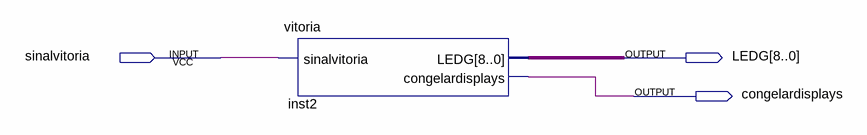
[diagram p0: schematic sheet]
// Quartus schematic esquematicotestevitoria.bdf as structural Verilog: 1 symbols, 3 pins
module esquematicotestevitoria (
  input  sinalvitoria,
  output [8:0] LEDG,
  output congelardisplays
);

  vitoria inst2 (.sinalvitoria(sinalvitoria), .LEDG(LEDG), .congelardisplays(congelardisplays));
endmodule
